# EAGLE schematic perspection-rf-v1 (EAGLE 7.4.0)
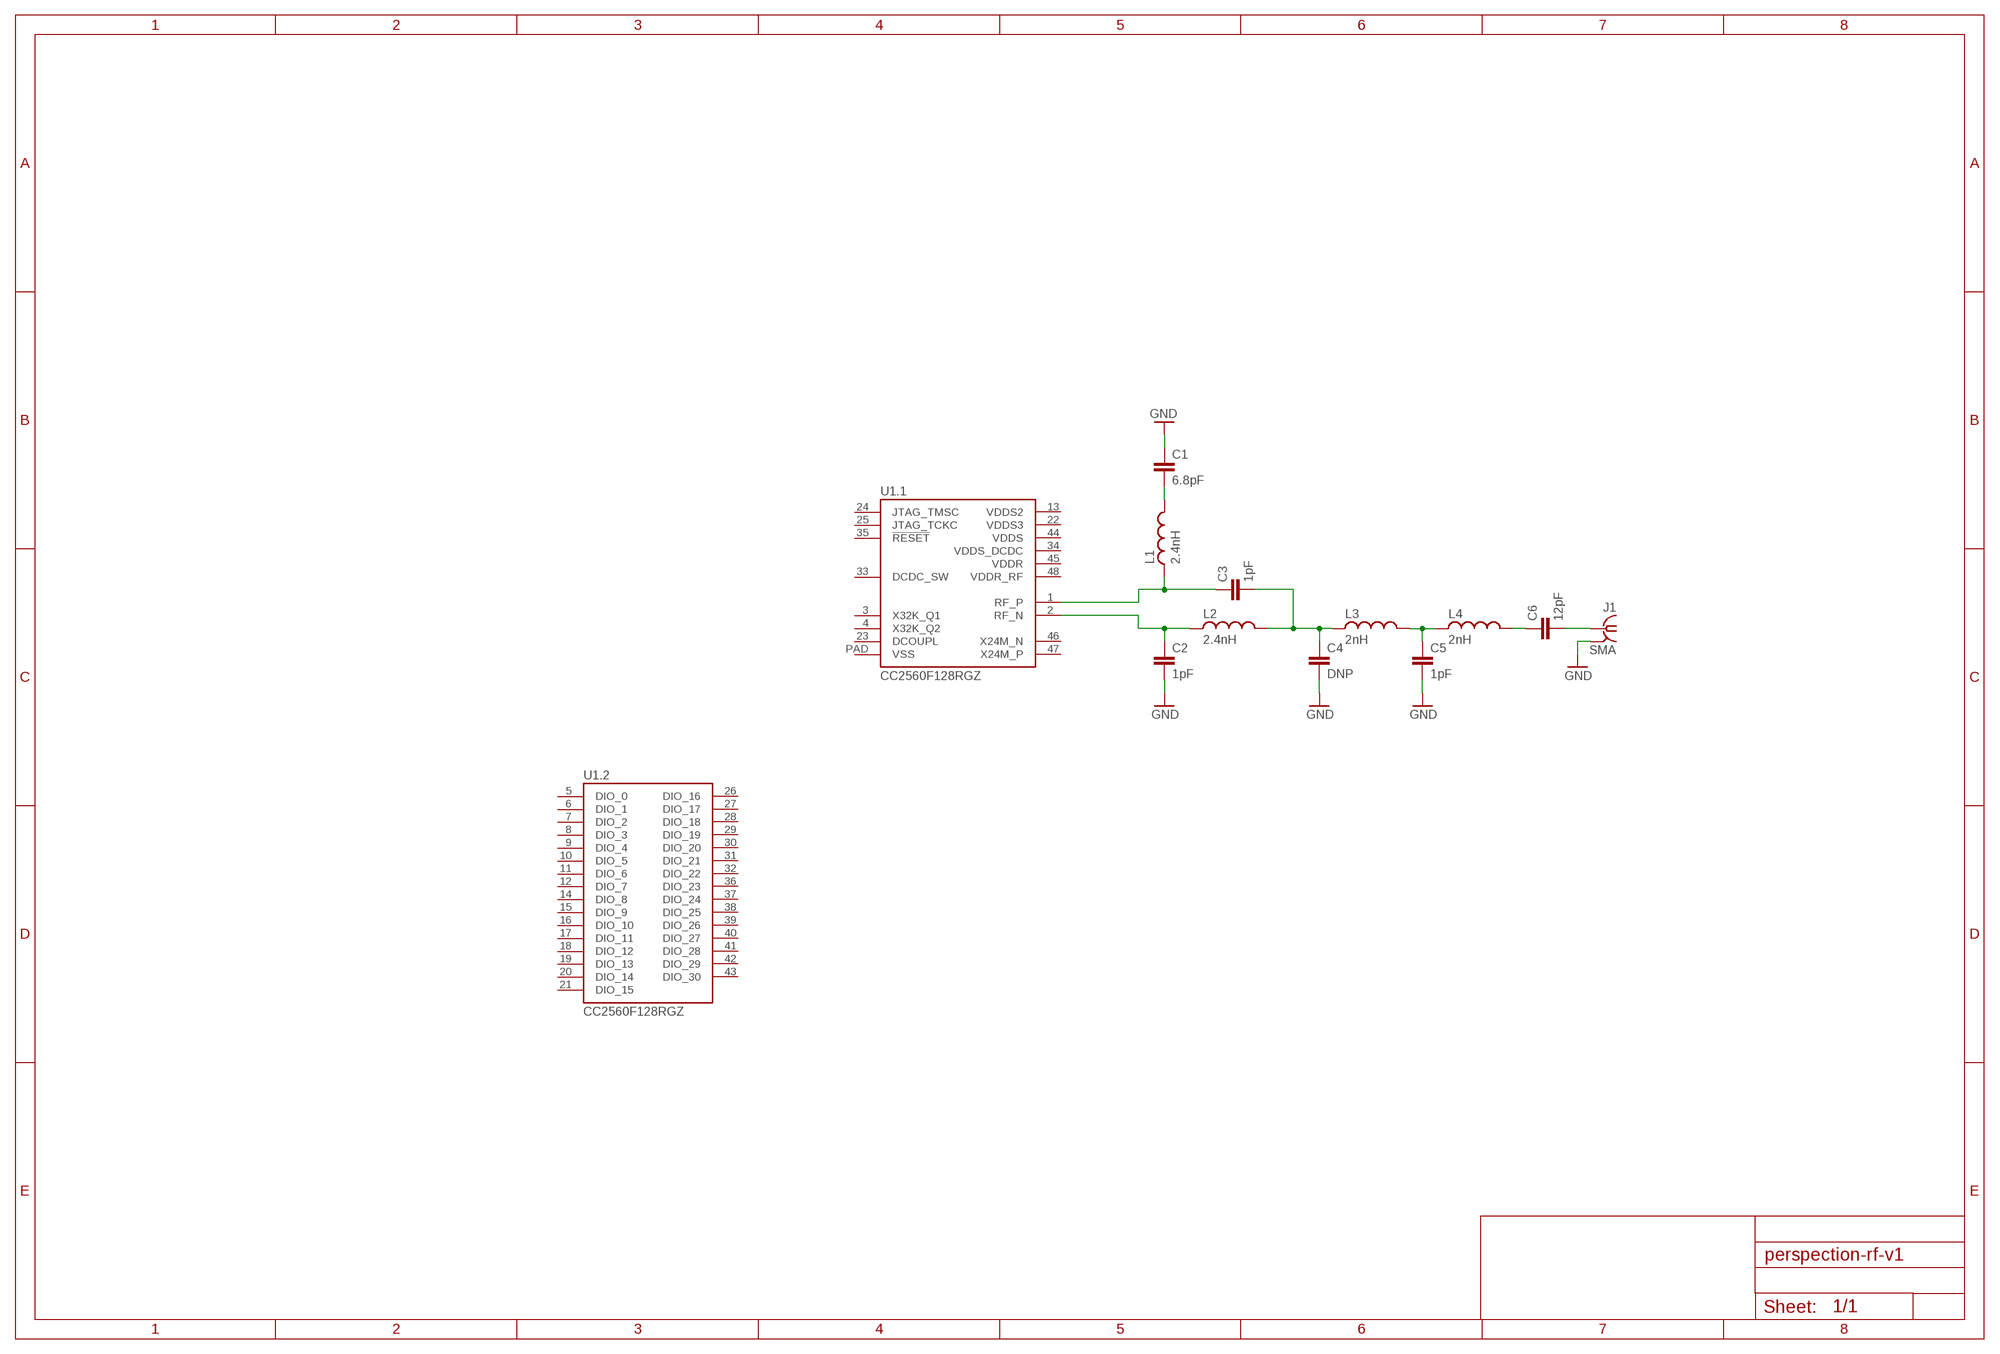
[diagram p0: schematic, sheet 1]

## Parts
C1  6.8pF  C0402  [C0402]
C2  1pF  C0402  [C0402]
C3  1pF  C0402  [C0402]
C4  DNP  C0402  [C0402]
C5  1pF  C0402  [C0402]
C6  12pF  C0402  [C0402]
J1  SMA  [SMA-VERT]
L1  2.4nH  L0402  [L0402]
L2  2.4nH  L0402  [L0402]
L3  2nH  L0402  [L0402]
L4  2nH  L0402  [L0402]
U1  CC2560F128RGZ  [TI-VQFN-48]

## Nets
GND: C1.1 C2.2 C4.2 C5.2 J1.NEG1(NEG) J1.NEG2(NEG) J1.NEG3(NEG) J1.NEG4(NEG)
N$1: C3.1 L1.1 U1.1(.1:RF_P)
N$2: C1.2 L1.2
N$3: C3.2 C4.1 L2.2 L3.1
N$4: C5.1 L3.2 L4.1
N$5: C6.1 L4.2
N$6: C6.2 J1.POS
N$7: C2.1 L2.1 U1.2(.1:RF_N)
Unconnected: U1.3(.1:X32K_Q1) U1.4(.1:X32K_Q2) U1.5(.2:DIO_0) U1.6(.2:DIO_1) U1.7(.2:DIO_2) U1.8(.2:DIO_3) U1.9(.2:DIO_4) U1.10(.2:DIO_5) U1.11(.2:DIO_6) U1.12(.2:DIO_7) U1.13(.1:VDDS2) U1.14(.2:DIO_8) U1.15(.2:DIO_9) U1.16(.2:DIO_10) U1.17(.2:DIO_11) U1.18(.2:DIO_12) U1.19(.2:DIO_13) U1.20(.2:DIO_14) U1.21(.2:DIO_15) U1.22(.1:VDDS3) U1.23(.1:DCOUPL) U1.24(.1:JTAG_TMSC) U1.25(.1:JTAG_TCKC) U1.26(.2:DIO_16) U1.27(.2:DIO_17) U1.28(.2:DIO_18) U1.29(.2:DIO_19) U1.30(.2:DIO_20) U1.31(.2:DIO_21) U1.32(.2:DIO_22) U1.33(.1:DCDC_SW) U1.34(.1:VDDS_DCDC) U1.35(.1:!RESET) U1.36(.2:DIO_23) U1.37(.2:DIO_24) U1.38(.2:DIO_25) U1.39(.2:DIO_26) U1.40(.2:DIO_27) U1.41(.2:DIO_28) U1.42(.2:DIO_29) U1.43(.2:DIO_30) U1.44(.1:VDDS) U1.45(.1:VDDR) U1.46(.1:X24M_N) U1.47(.1:X24M_P) U1.48(.1:VDDR_RF) U1.PAD(.1:VSS)

## Library data of the parts
C1-C6 = perspection:C
J1 = perspection:SMA: CONN SMA JACK STR 50 OHM PCB; DIST_NAME: Digi-Key; DIST_PN: A97594-ND; MFG_NAME: TE Connectivity AMP Connectors; MFG_PN: 5-1814832-1
L1-L4 = perspection:L
U1 = perspection:CC2560F128RGZ